# Altium schematic sheet [04] - SIM800C.SchDoc: =ProjectName
size A4; CheckedBy: Ven; Author: Ven; CompanyName: HUST; Revision: V.1.0
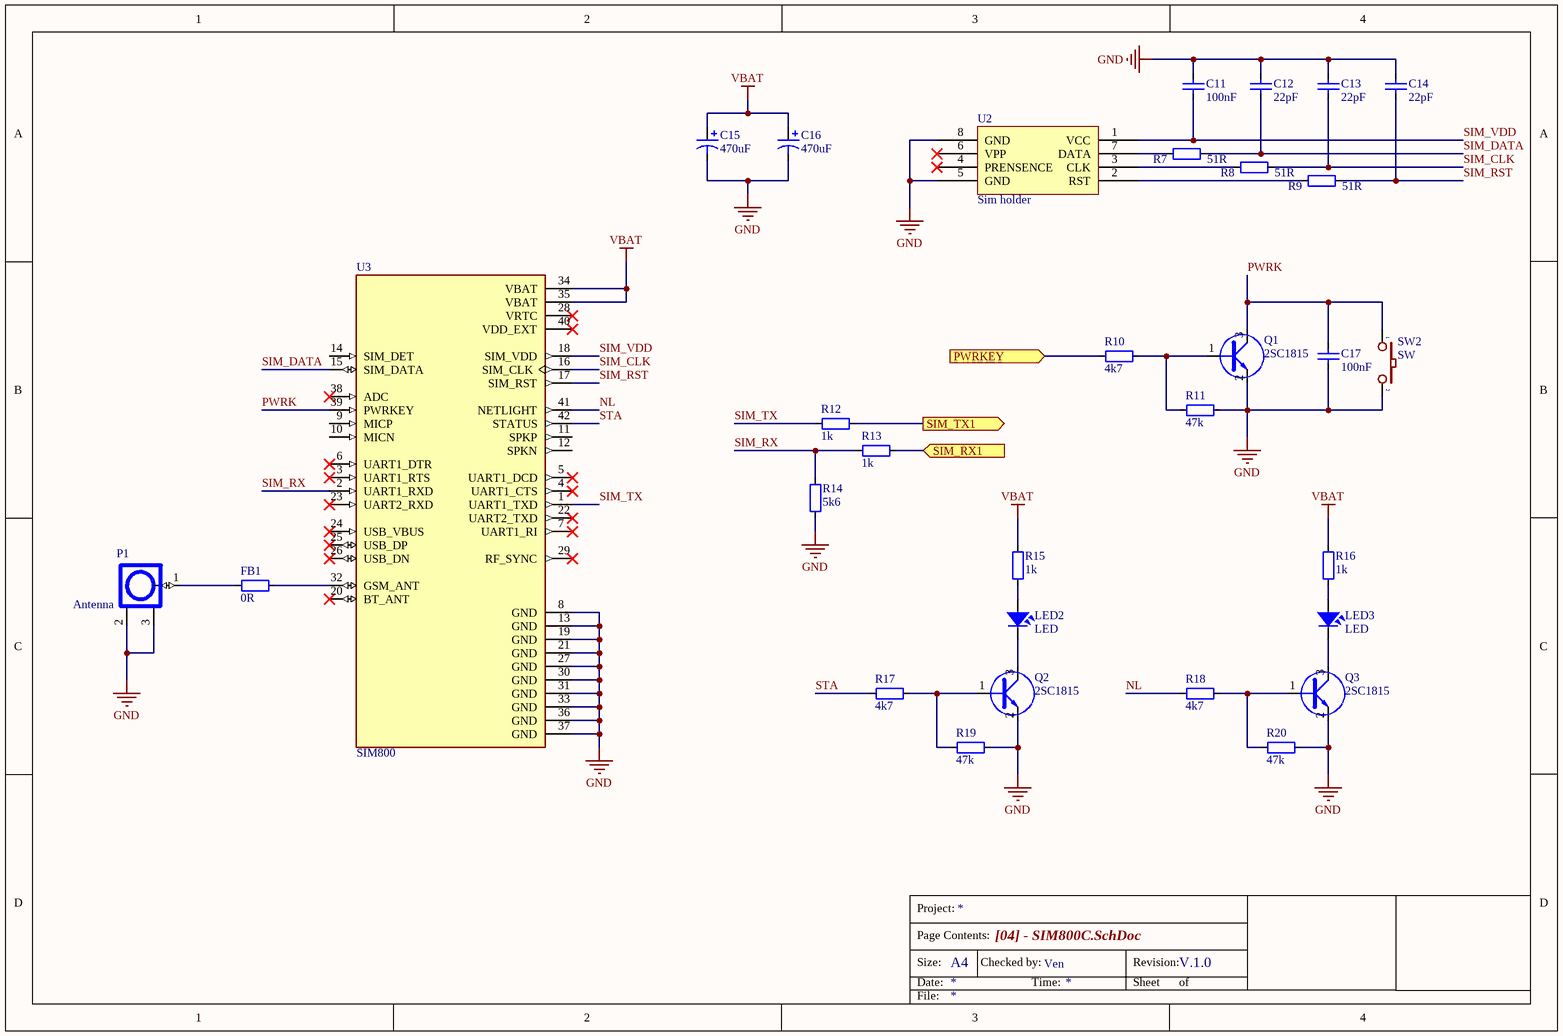
[diagram p0: [04] - SIM800C.SchDoc]

## Parts
C11  100nF  [CAP_0603]
C12  22pF  [CAP_0603]
C13  22pF  [CAP_0603]
C14  22pF  [CAP_0603]
C15  470uF  [CAP_7343]
C16  470uF  [CAP_7343]
C17  100nF  [CAP_0603]
FB1  0R  [RES-SMD-0603]
LED2  LED  [LED-0805-Green]
LED3  LED  [LED-0805-Green]
P1  Antenna  [IPXS]
Q1  2SC1815  [SOT23]
Q2  2SC1815  [SOT23]
Q3  2SC1815  [SOT23]
R7  51R  [RES-SMD-0603]
R8  51R  [RES-SMD-0603]
R9  51R  [RES-SMD-0603]
R10  4k7  [RES-SMD-0603]
R11  47k  [RES-SMD-0603]
R12  1k  [RES-SMD-0603]
R13  1k  [RES-SMD-0603]
R14  5k6  [RES-SMD-0603]
R15  1k  [RES-SMD-0603]
R16  1k  [RES-SMD-0603]
R17  4k7  [RES-SMD-0603]
R18  4k7  [RES-SMD-0603]
R19  47k  [RES-SMD-0603]
R20  47k  [RES-SMD-0603]
SW2  SW  [SW2]
U2  value Sim holder  [Sim Socket]  (hidden comment: SIM-KF016)
U3  SIM800  [SIM800C]

## Ports
PWRKEY (in), SIM_RX1 (in), SIM_TX1 (out)

## Nets
GND: C11.2 C12.2 C13.2 C14.2 C15.2 C16.2 C17.1 P1.2 P1.3 Q1.2(E) Q2.2(E) Q3.2(E) R11.2 R14.1 R19.2 R20.2 SW2.2 U2.5(GND) U2.8(GND) U3.8(GND) U3.13(GND) U3.19(GND) U3.21(GND) U3.27(GND) U3.30(GND) U3.31(GND) U3.33(GND) U3.36(GND) U3.37(GND)
VBAT: C15.1 C16.1 R15.2 R16.2 U3.34(VBAT) U3.35(VBAT)
NL: R18.1 U3.41(NETLIGHT)
PWRK: C17.2 Q1.3(C) SW2.1 U3.39(PWRKEY)
PWRKEY: R10.1 ; port PWRKEY
SIM_CLK: C13.1 R8.2 U3.16(SIM_CLK)
SIM_DATA: C12.1 R7.2 U3.15(SIM_DATA)
SIM_RST: C14.1 R9.2 U3.17(SIM_RST)
SIM_RX: R13.2 R14.2 U3.2(UART1_RXD)
SIM_RX1: R13.1 ; port SIM_RX1
SIM_TX: R12.2 U3.1(UART1_TXD)
SIM_TX1: R12.1 ; port SIM_TX1
SIM_VDD: C11.1 U2.1(VCC) U3.18(SIM_VDD)
STA: R17.1 U3.42(STATUS)
NetFB1_1: FB1.1 P1.1
NetFB1_2: FB1.2 U3.32(GSM_ANT)
NetLED2_1: LED2.1 R15.1
NetLED2_2: LED2.2 Q2.3(C)
NetLED3_1: LED3.1 R16.1
NetLED3_2: LED3.2 Q3.3(C)
NetQ1_1: Q1.1(B) R10.2 R11.1
NetQ2_1: Q2.1(B) R17.2 R19.1
NetQ3_1: Q3.1(B) R18.2 R20.1
NetR7_1: R7.1 U2.7(DATA)
NetR8_1: R8.1 U2.3(CLK)
NetR9_1: R9.1 U2.2(RST)

Not connected (* = marked no-connect by the designer): U2 4(PRENSENCE)* 6(VPP)*; U3 3(UART1_RTS)* 4(UART1_CTS)* 5(UART1_DCD)* 6(UART1_DTR)* 7(UART1_RI)* 9(MICP) 10(MICN) 11(SPKP) 12(SPKN) 14(SIM_DET) 20(BT_ANT)* 22(UART2_TXD)* 23(UART2_RXD)* 24(USB_VBUS)* 25(USB_DP)* 26(USB_DN)* 28(VRTC)* 29(RF_SYNC)* 38(ADC)* 40(VDD_EXT)*

## Notes on the sheet
- Project:
- Page Contents:
- Size:
- Date:
- A4
- Checked by:
- Time:
- Revision:
- Sheet
- of
- File:

## Library data of the parts
C11-C14 C17 = CapSMD: Capacitor; Value: 33p; Published: 8-Jun-2000; LatestRevisionDate: 17-Jul-2002; LatestRevisionNote: Re-released for DXP Platform.; PackageReference: RAD-0.3; Publisher: Altium Limited
C15 C16 = Cap Pol: Polarized Capacitor (Axial); Published: 8-Jun-2000; LatestRevisionDate: 17-Jul-2002; LatestRevisionNote: Re-released for DXP Platform.; PackageReference: POLAR0.8; Publisher: Altium Limited
FB1 R7-R20 = Resistor - SMD: Resistor; Manufacturer: Generic Components; Class: Passive; Published: 08/06/2000; Publisher: Altium Hobart Technology Centre
LED2 LED3 = LED: LED Single colour Green and Red; Value: LED 3 ly Single Colour
P1 = IPXSx66: Antenna GSM GPS
Q1-Q3 = 2SC1815: NPN 600mW, ECB; Value: C1815
SW2 = SW2: Switch button 2 pin; Value: SW chip 2 pin
U2 = Sim holder: SIM Card Holder KF-016
U3 = SIM800C: SIM800C IC